# EAGLE design TCC_COMPLETO1 (EAGLE 4.16)
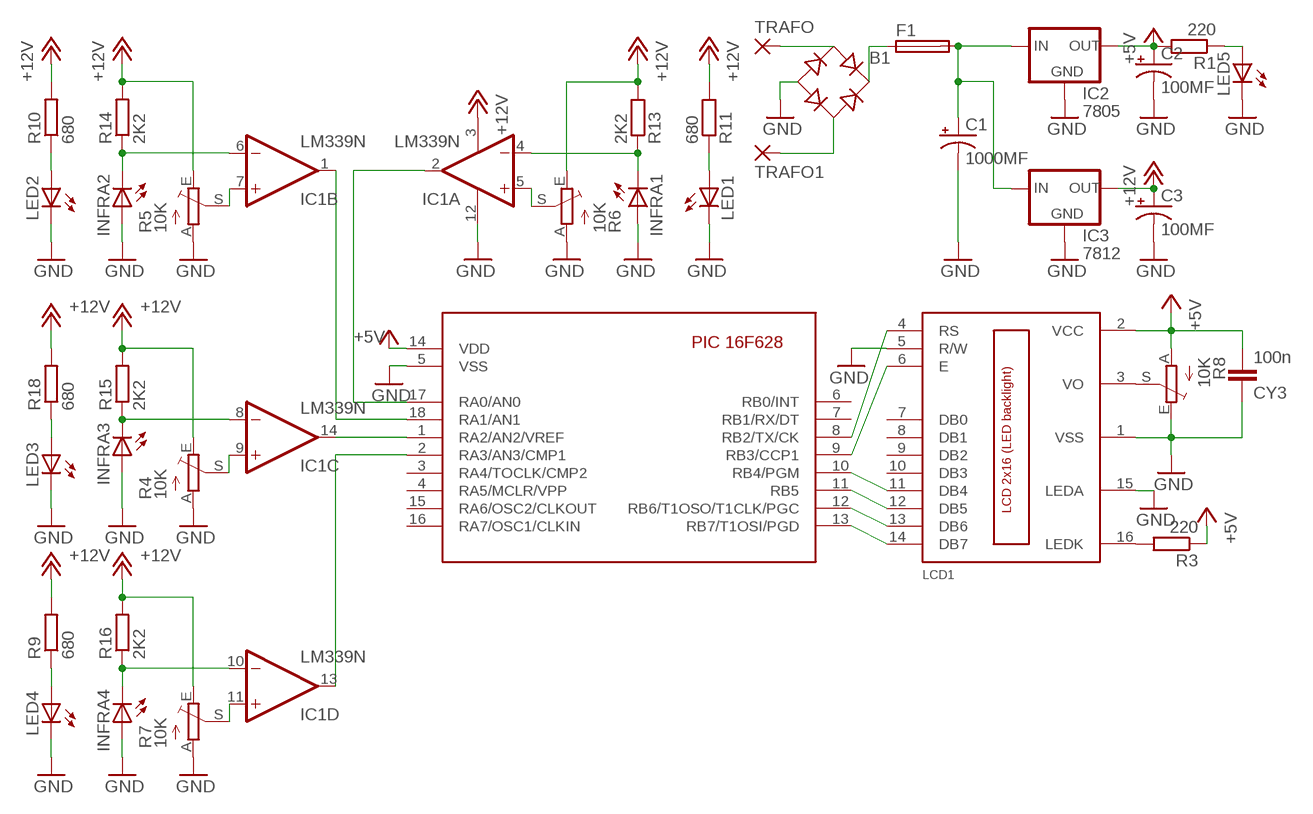
[diagram p0: schematic, sheet 1]

## Parts
B1  RB1A  [RB1A]
C1  1000MF  CPOL-USE5-10.5  [E5-10,5]
C2  100MF  CPOL-USE5-8.5  [E5-8,5]
C3  100MF  CPOL-USE5-8.5  [E5-8,5]
CY3  100n  CYYC7B5  [YC7B5]
F1  SH22,5  [SH22,5]
IC1  LM339N  [DIL14]
IC2  7805  78XXS  [78XXS]
IC3  7812  78XXS  [78XXS]
INFRA1  LED5MM  [LED5MM]
INFRA2  LED5MM  [LED5MM]
INFRA3  LED5MM  [LED5MM]
INFRA4  LED5MM  [LED5MM]
LCD1  LCD_2X16  [HY-1602F]
LED1  LED5MM  [LED5MM]
LED2  LED5MM  [LED5MM]
LED3  LED5MM  [LED5MM]
LED4  LED5MM  [LED5MM]
LED5  LED5MM  [LED5MM]
R1  220  R-EU_0309/12  [0309/12]
R3  220  R-EU_0207/10  [0207/10]
R4  10K  TRIM_EU-LI10  [LI10]
R5  10K  TRIM_EU-LI10  [LI10]
R6  10K  TRIM_EU-LI10  [LI10]
R7  10K  TRIM_EU-LI10  [LI10]
R8  10K  TRIM_EU-LI10  [LI10]
R9  680  R-EU_0309/12  [0309/12]
R10  680  R-EU_0309/12  [0309/12]
R11  680  R-EU_0309/12  [0309/12]
R13  2K2  R-EU_0207/10  [0207/10]
R14  2K2  R-EU_0207/10  [0207/10]
R15  2K2  R-EU_0207/10  [0207/10]
R16  2K2  R-EU_0207/10  [0207/10]
R18  680  R-EU_0309/12  [0309/12]
TRAFO  2,54/1,0  [2,54/1,0]
TRAFO1  2,54/1,0  [2,54/1,0]
U$1  16F628  [PIC16F628-18-LEAD-PDIP]

## Nets
+5V: C2.+ CY3.2 IC2.OUT LCD1.2(VCC) R1.2 R3.1 R8.A U$1.14(VDD)
+12V: C3.+ IC1.3(P:V+) IC3.OUT R4.E R5.E R6.E R7.E R9.2 R10.2 R11.2 R13.2 R14.2 R15.2 R16.2 R18.2
GND: B1.- C1.- C2.- C3.- CY3.1 IC1.12(P:GND) IC2.GND IC3.GND INFRA1.A INFRA2.A INFRA3.A INFRA4.A LCD1.1(VSS) LCD1.5(R/W) LCD1.15(LEDA) LED1.K(C) LED2.K(C) LED3.K(C) LED4.K(C) LED5.K(C) R4.A R5.A R6.A R7.A R8.E U$1.5(VSS)
N$1: LCD1.4(RS) U$1.8(RB2/TX/CK)
N$2: LCD1.6(E) U$1.9(RB3/CCP1)
N$3: LCD1.14(DB7) U$1.13(RB7/T1OSI/PGD)
N$4: LCD1.13(DB6) U$1.12(RB6/T1OSO/T1CLK/PGC)
N$5: LCD1.12(DB5) U$1.11(RB5)
N$6: LCD1.11(DB4) U$1.10(RB4/PGM)
N$7: IC1.5(A:+IN) R6.S
N$8: LED5.A R1.1
N$13: LCD1.3(VO) R8.S
N$14: IC1.7(B:+IN) R5.S
N$15: LCD1.16(LEDK) R3.2
N$16: IC1.11(D:+IN) R7.S
N$17: IC1.9(C:+IN) R4.S
N$18: LED1.A R11.1
N$19: LED2.A R10.1
N$20: LED3.A R18.1
N$21: LED4.A R9.1
N$22: IC1.4(A:-IN) INFRA1.K(C) R13.1
N$23: IC1.8(C:-IN) INFRA3.K(C) R15.1
N$24: IC1.10(D:-IN) INFRA4.K(C) R16.1
N$26: IC1.2(A:OUT) U$1.17(RA0/AN0)
N$27: B1.AC1 TRAFO.1(P)
N$28: C1.+ F1.2 IC2.IN IC3.IN
N$29: B1.AC2 TRAFO1.1(P)
N$30: B1.+ F1.1
N$31: IC1.1(B:OUT) U$1.18(RA1/AN1)
N$32: IC1.14(C:OUT) U$1.1(RA2/AN2/VREF)
N$33: IC1.13(D:OUT) U$1.2(RA3/AN3/CMP1)
N$34: IC1.6(B:-IN) INFRA2.K(C) R14.1
Unconnected: LCD1.7(DB0) LCD1.8(DB1) LCD1.9(DB2) LCD1.10(DB3) U$1.3(RA4/TOCLK/CMP2) U$1.4(RA5/MCLR/VPP) U$1.6(RB0/INT) U$1.7(RB1/RX/DT) U$1.15(RA6/OSC2/CLKOUT) U$1.16(RA7/OSC1/CLKIN)

## Library data of the parts
B1 = rectifier:RB1A: RECTIFIER 1 A
C1-C3 = rcl:CPOL-US: POLARIZED CAPACITOR, American symbol
CY3 = rcl:CY: Y CAPACITOR for power line
F1 = fuse:SH22,5: FUSE HOLDER grid 22,5 mm, OGN0031 8201, Schurter (Buerklin)
IC1 = linear:LM339: Low Power Low Offset Voltage Quad Comparators with open collector; LM139/LM239/LM339/LM2901/LM3302
IC2 IC3 = v-reg:78XXS: VOLTAGE REGULATOR
INFRA1-INFRA4 LED1-LED5 = led:LED: LED OSRAM: - CHIPLED LG R971, LG N971, LY N971, LG Q971, LY Q971, LO R971, LY R971 LH N974, LH R974 LS Q976, LO Q976, LY Q976 LO Q996 - Hyper CHIPLED LW Q18S LB Q993, LB Q99A, LB R99A - SideLED LS A670, LO A670, LY A670, LG A670, LP A670 LB A673, LV A673, LT A673, LW A673 LH A674 LY A675 LS A676, LA A676, LO A676, LY A676, LW A676 LS A679, LY A679, LG A679 - Hyper Micro SIDELED® LS Y876, LA Y876, LO Y876, LY Y876 LT Y87S - SmartLED LW L88C, LW L88S LB L89C, LB L89S, LG L890 LS L89K, LO L89K, LY L89K LS L896, LA L896, LO L896, LY L896 - TOPLED LS T670, LO T670, LY T670, LG T670, LP T670 LSG T670, LSP T670, LSY T670, LOP T670, LYG T670 LG T671, LOG T671, LSG T671 LB T673, LV T673, LT T673, LW T673 LH T674 LS T676, LA T676, LO T676, LY T676, LB T676, LH T676, LSB T676, LW T676 LB T67C, LV T67C, LT T67C, LS T67K, LO T67K, LY T67K, LW E67C LS E67B, LA E67B, LO E67B, LY E67B, LB E67C, LV E67C, LT E67C LW T67C LS T679, LY T679, LG T679 LS T770, LO T770, LY T770, LG T770, LP T770 LB T773, LV T773, LT T773, LW T773 LH T774 LS E675, LA E675, LY E675, LS T675 LS T776, LA T776, LO T776, LY T776, LB T776 LHGB T686 LT T68C, LB T68C - Hyper Mini TOPLED® LB M676 - Mini TOPLED Santana® LG M470 LS M47K, LO M47K, LY M47K Source: http://www.osram.convergy.de - LUMILED® LXK2-PW12-R00, LXK2-PW12-S00, LXK2-PW14-U00, LXK2-PW14-V00 LXK2-PM12-R00, LXK2-PM12-S00, LXK2-PM14-U00 LXK2-PE12-Q00, LXK2-PE12-R00, LXK2-PE12-S00, LXK2-PE14-T00, LXK2-PE14-U00 LXK2-PB12-K00, LXK2-PB12-L00, LXK2-PB12-M00, LXK2-PB14-N00, LXK2-PB14-P00, LXK2-PB14-Q00 LXK2-PR12-L00, LXK2-PR12-M00, LXK2-PR14-Q00, LXK2-PR14-R00 LXK2-PD12-Q00, LXK2-PD12-R00, LXK2-PD12-S00 LXK2-PH12-R00, LXK2-PH12-S00 LXK2-PL12-P00, LXK2-PL12-Q00, LXK2-PL12-R00 Source: www.luxeon.com
LCD1 = lcd_2x16_led_backlight:LCD_2X16
R1 R3 R9-R11 R13-R16 R18 = rcl:R-EU_: RESISTOR, European symbol
R4-R8 = pot:TRIM_EU-: POTENTIOMETER
TRAFO TRAFO1 = wirepad:2,54/1,0: THROUGH-HOLE PAD
U$1 = pic16f6xx-1:16F628: Microchip component PIC 16F628 Eric Magraner - eric_magraner@yahoo.fr 03/2004

## Board
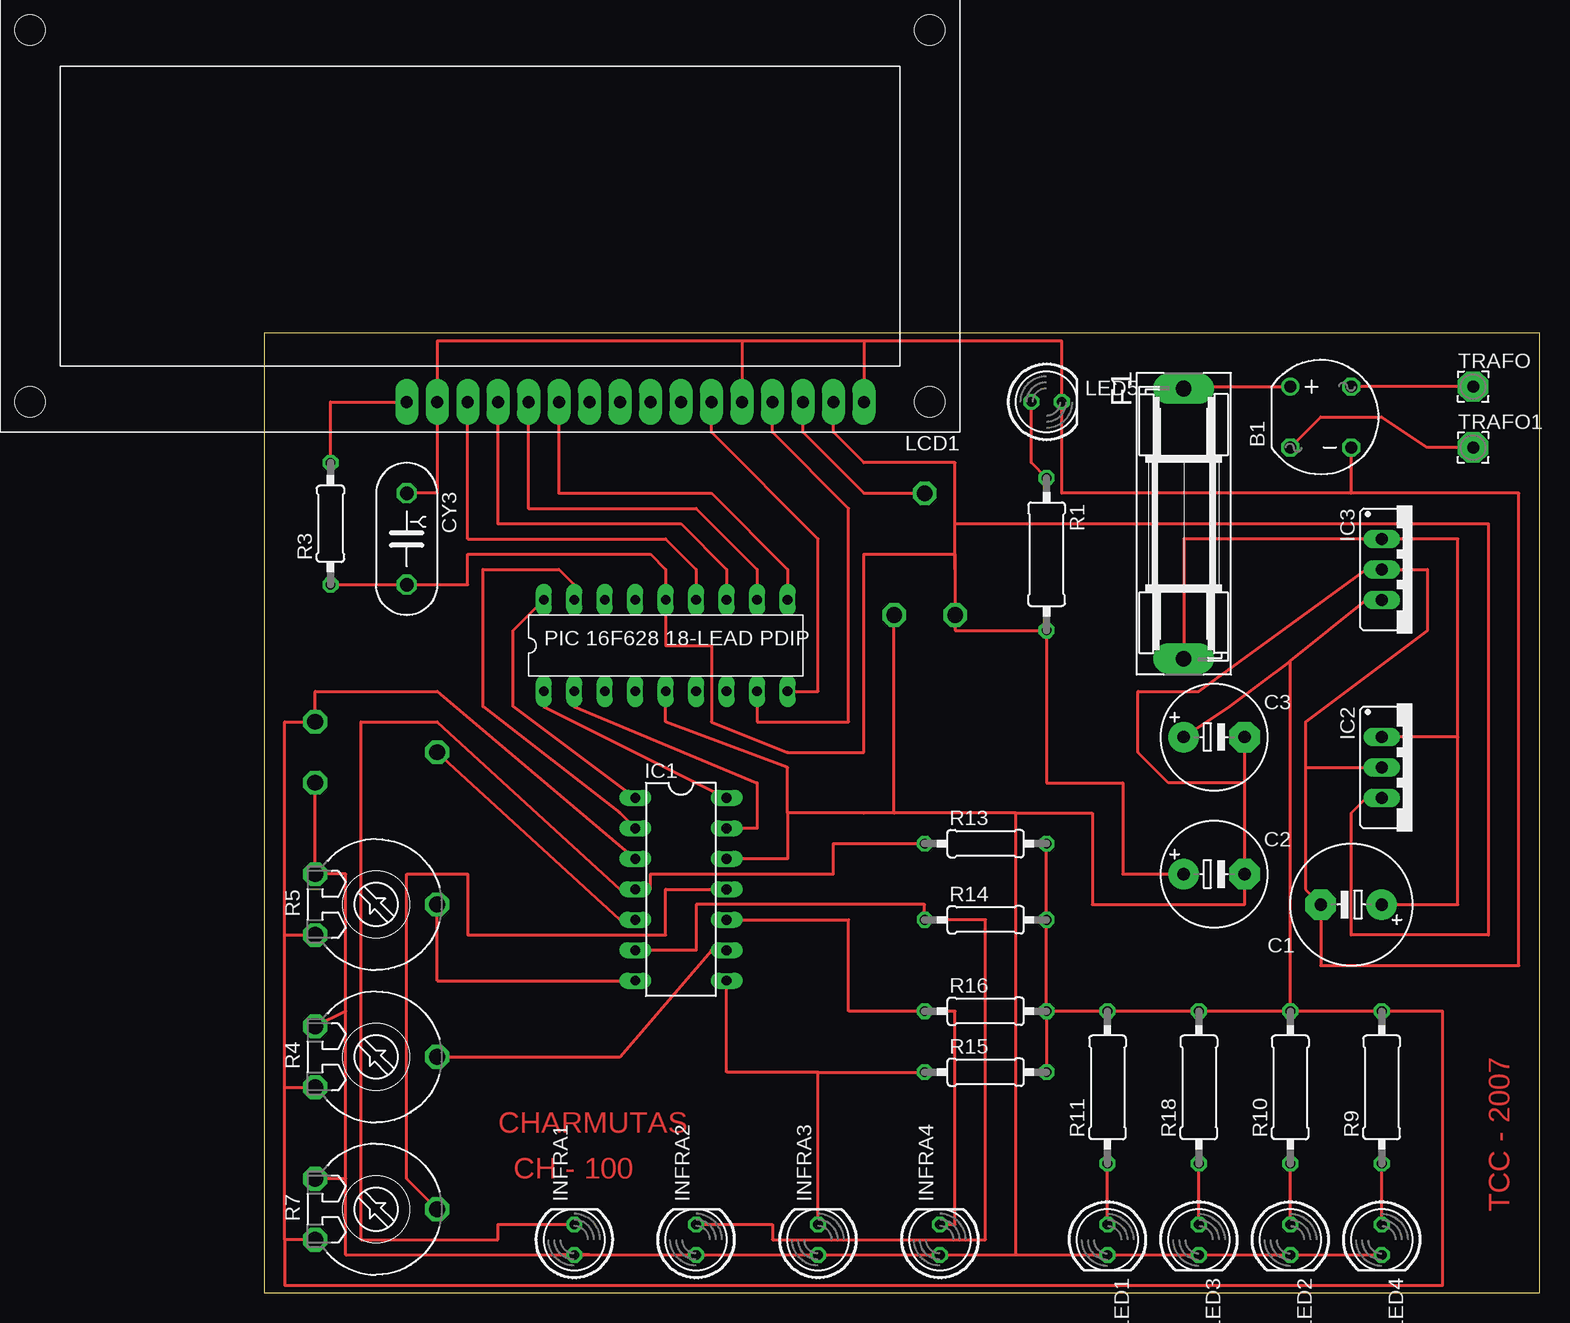
[diagram p1: board, top side]
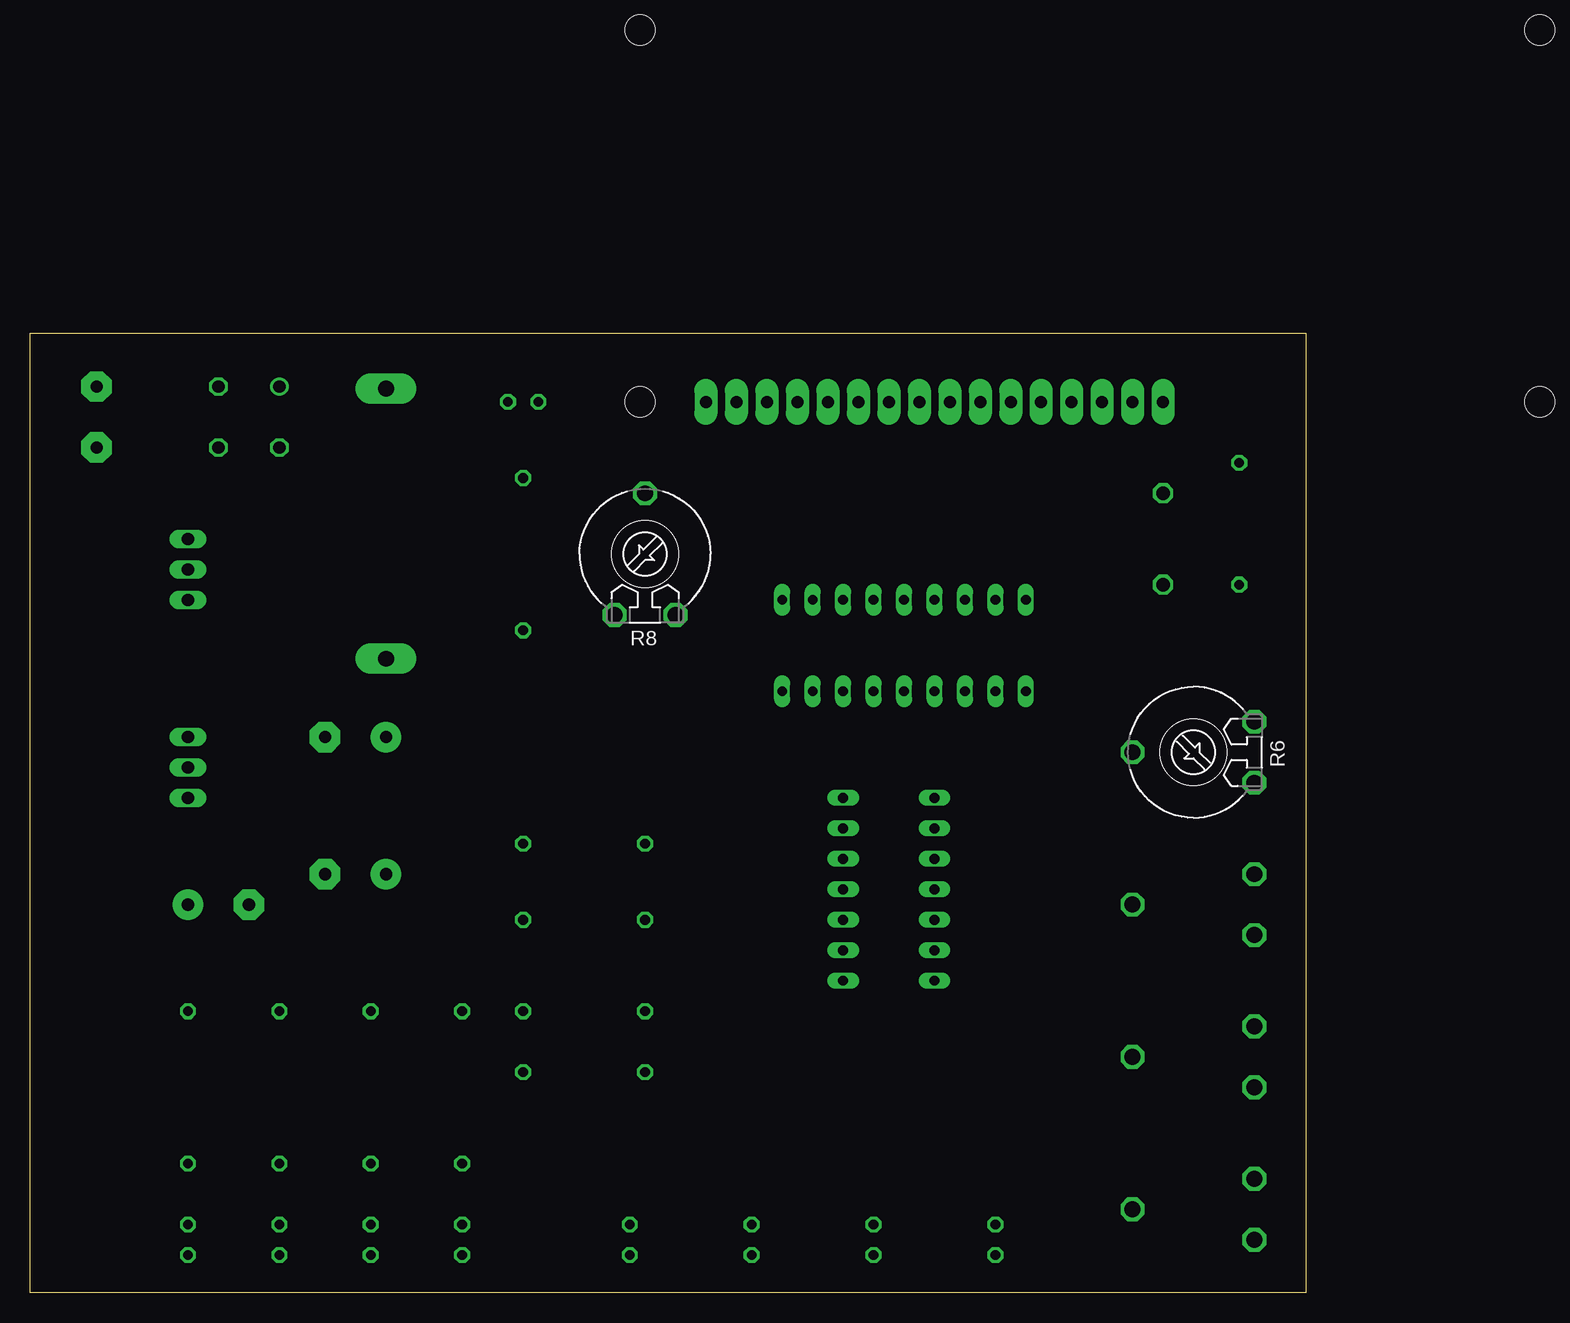
[diagram p2: board, bottom side, seen from below]

Size 106.35 x 80 mm. Coordinates in mm from the lower left corner, seen from the top.
Outline: 0,0 106.35,0 106.35,80 0,80 0,0
Copper layers 1: Top 0.035mm
Design rules "default": minimum track width 10mil, minimum drill 24mil, track to track 8mil, track to pad 8mil, pad to pad 8mil, via to via 8mil, smd to smd 8mil, copper to edge 40mil, drill to drill 8mil, minimum pad ring 10mil, minimum via ring 8mil, stop-mask expansion 4mil, vias tented up to drill 0mil, thermal gap 10mil

### Footprints (pad centres in the part's own frame; a part is rotated, then mirrored left to right if it is on the bottom)
RB1A = drill 1.016 round: + -2.54,2.54 | drill 1.016 octagon: - 2.54,-2.54; AC1 2.54,2.54; AC2 -2.54,-2.54
E5-10,5 = drill 1.016 pad 2.54 round: + -2.54,0 | drill 1.016 pad 2.54 octagon: - 2.54,0
E5-8,5 = drill 1.016 pad 2.54 round: + -2.54,0 | drill 1.016 pad 2.54 octagon: - 2.54,0
YC7B5 = drill 1.118 octagon: 1 -3.81,0; 2 3.81,0
SH22,5 = drill 1.321 pad 2.54 long: 1 -11.252,0; 2 11.252,0
DIL14 = drill 0.813 long: 1 -7.62,-3.81; 2 -5.08,-3.81; 3 -2.54,-3.81; 4 0,-3.81; 5 2.54,-3.81; 6 5.08,-3.81; 7 7.62,-3.81; 8 7.62,3.81; 9 5.08,3.81; 10 2.54,3.81; 11 0,3.81; 12 -2.54,3.81; 13 -5.08,3.81; 14 -7.62,3.81
78XXS = drill 1.016 long: GND 0,-2.54; IN -2.54,-2.54; OUT 2.54,-2.54
LED5MM = drill 0.813 octagon: A -1.27,0; K 1.27,0
HY-1602F = drill 1 pad 1.93 long: 1 2.54,0; 2 5.08,0; 3 7.62,0; 4 10.16,0; 5 12.7,0; 6 15.24,0; 7 17.78,0; 8 20.32,0; 9 22.86,0; 10 25.4,0; 11 27.94,0; 12 30.48,0; 13 33.02,0; 14 35.56,0; 15 38.1,0; 16 40.64,0 | hole 2.5: -2.96,0; 72.04,0; -2.96,-31; 72.04,-31
0309/12 = drill 0.813 octagon: 1 -6.35,0; 2 6.35,0
0207/10 = drill 0.813 octagon: 1 -5.08,0; 2 5.08,0
LI10 = drill 1.321 octagon: A -2.54,-5.08; E 2.54,-5.08; S 0,5.08
2,54/1,0 = drill 1.016 pad 2.54 octagon: 1 0,0
PIC16F628-18-LEAD-PDIP = drill 0.813 long: 1 -10.16,-3.81; 2 -7.62,-3.81; 3 -5.08,-3.81; 4 -2.54,-3.81; 5 0,-3.81; 6 2.54,-3.81; 7 5.08,-3.81; 8 7.62,-3.81; 9 10.16,-3.81; 10 10.16,3.81; 11 7.62,3.81; 12 5.08,3.81; 13 2.54,3.81; 14 0,3.81; 15 -2.54,3.81; 16 -5.08,3.81; 17 -7.62,3.81; 18 -10.16,3.81

### Placement (x,y rotation side)
B1  88.1,73.02 0 top
C1  90.64,32.38 180 top
C2  79.21,34.92 0 top
C3  79.21,46.35 0 top
CY3  11.9,62.86 270 top
F1  76.67,64.13 270 top
IC1  34.76,33.65 270 top
IC2  95.72,43.81 270 top
IC3  95.72,60.32 270 top
INFRA1  25.87,4.44 90 top
INFRA2  36.03,4.44 90 top
INFRA3  46.19,4.44 90 top
INFRA4  56.35,4.44 90 top
LCD1  52.54,74.29 180 top
LED1  70.32,4.44 270 top
LED2  85.56,4.44 270 top
LED3  77.94,4.44 270 top
LED4  93.18,4.44 270 top
LED5  65.24,74.29 0 top
R1  65.24,61.59 270 top
R3  5.55,64.13 90 top
R4  9.36,19.68 270 top
R5  9.36,32.38 270 top
R6  9.36,45.08 90 bottom
R7  9.36,6.98 270 top
R8  55.08,61.59 0 bottom
R9  93.18,17.14 90 top
R10  85.56,17.14 90 top
R11  70.32,17.14 90 top
R13  60.16,37.46 0 top
R14  60.16,31.11 0 top
R15  60.16,18.41 0 top
R16  60.16,23.49 0 top
R18  77.94,17.14 90 top
TRAFO  100.8,75.56 0 top
TRAFO1  100.8,70.48 0 top
U$1  33.49,53.97 0 top

### Tracks (layer width: path | path; a pad name or v marks a point on that pad's centre or on a via)
+5V
  Top 0.254: 10.63,59.05 CY3.2 | 33.49,60.32 32.22,61.59 16.98,61.59 16.98,59.05 10.63,59.05 | R3.1 10.63,59.05 | 33.49,60.32 U$1.14 | 33.49,60.32 33.49,53.97 37.3,53.97 37.3,47.62 43.65,45.08 50,45.08 50,61.59 57.62,61.59 57.62,60.32 | 57.62,60.32 R8.A 57.62,55.24 R1.2 65.24,42.54 71.59,42.54 71.59,34.92 C2.+ | LCD1.2 47.46,71.75 50,69.21 57.62,69.21 57.62,64.13 | 57.62,60.32 57.62,64.13 | 57.62,64.13 102.07,64.13 102.07,29.84 90.64,29.84 90.64,40 91.91,41.27 IC2.OUT
+12V
  Top 0.254: 1.74,17.14 R4.E | 1.74,29.84 R5.E | 1.74,17.14 1.74,29.84 | 1.74,29.84 1.74,47.62 R6.E 4.28,50.16 14.44,50.16 IC1.3 | R16.2 R15.2 | R16.2 R11.2 R18.2 R10.2 | R16.2 R14.2 R13.2 | R10.2 R9.2 98.26,23.49 98.26,0.63 1.74,0.63 1.74,4.44 | 85.56,52.7 91.91,57.78 IC3.OUT | R10.2 85.56,52.7 | C3.+ 80.48,48.89 85.56,52.7 | 1.74,4.44 1.74,17.14 | R7.E 1.74,4.44
GND
  Top 0.254: 39.84,79.37 14.44,79.37 LCD1.15 14.44,66.67 CY3.1 | 39.84,79.37 LCD1.5 | 50,79.37 66.51,79.37 LED5.K 66.51,66.67 90.64,66.67 | R6.A R5.A 6.82,34.92 6.82,23.49 | 6.82,23.49 R4.A | 27.14,3.17 INFRA1.A 24.6,3.17 | 27.14,3.17 INFRA2.A INFRA3.A INFRA4.A 62.7,3.17 | LED4.K LED2.K LED3.K LED1.K 62.7,3.17 | 6.82,9.52 6.82,3.17 27.14,3.17 | 6.82,9.52 6.82,23.49 | 6.82,9.52 R7.A | 52.54,40 R8.E | U$1.5 33.49,47.62 43.65,43.81 43.65,40 | IC1.12 43.65,36.19 43.65,40 | 50,79.37 LCD1.1 | 50,79.37 39.84,79.37 | 81.75,42.54 75.4,42.54 72.86,45.08 72.86,50.16 77.94,50.16 91.91,60.32 IC3.GND 96.99,60.32 96.99,55.24 86.83,47.62 86.83,43.81 | 81.75,42.54 C3.- | 81.75,42.54 C2.- 81.75,32.38 69.05,32.38 69.05,40 62.7,40 | 62.7,40 52.54,40 | 52.54,40 50,40 | 90.64,66.67 B1.- | 90.64,66.67 104.61,66.67 104.61,27.3 88.1,27.3 C1.- 86.83,33.65 86.83,43.81 | 50,40 43.65,40 | 62.7,40 50,40 | 62.7,3.17 62.7,40 | 86.83,43.81 IC2.GND
N$1
  Top 0.254: U$1.8 41.11,47.62 48.73,47.62 48.73,65.4 42.38,71.75 LCD1.4
N$2
  Top 0.254: U$1.9 46.19,50.16 46.19,62.86 37.3,71.75 LCD1.6
N$3
  Top 0.254: U$1.13 36.03,60.32 33.49,62.86 16.98,62.86 LCD1.14
N$4
  Top 0.254: U$1.12 38.57,60.32 34.76,64.13 19.52,64.13 LCD1.13
N$5
  Top 0.254: U$1.11 41.11,60.32 36.03,65.4 22.06,65.4 LCD1.12
N$6
  Top 0.254: LCD1.11 24.6,66.67 37.3,66.67 43.65,60.32 U$1.10
N$7
  Top 0.254: R6.S 29.68,31.11 IC1.5
N$8
  Top 0.254: R1.1 63.97,69.21 LED5.A
N$13
  Top 0.254: R8.S 50,66.67 44.92,71.75 LCD1.3
N$14
  Top 0.254: R5.S 14.44,26.03 IC1.7
N$15
  Top 0.254: R3.2 5.55,74.29 LCD1.16
N$16
  Top 0.254: R7.S 11.9,9.52 11.9,34.92 16.98,34.92 16.98,29.84 33.49,29.84 33.49,33.65 IC1.11
N$17
  Top 0.254: R4.S 29.68,19.68 37.3,28.57 IC1.9
N$18
  Top 0.254: LED1.A R11.1
N$19
  Top 0.254: LED2.A R10.1
N$20
  Top 0.254: LED3.A R18.1
N$21
  Top 0.254: LED4.A R9.1
N$22
  Top 0.254: INFRA1.K 19.52,5.71 19.52,4.44 8.09,4.44 8.09,47.62 14.44,47.62 29.68,33.65 IC1.4 32.22,33.65 32.22,34.92 47.46,34.92 47.46,37.46 R13.1
N$23
  Top 0.254: 46.19,18.41 R15.1 | 46.19,18.41 38.57,18.41 IC1.8 | INFRA3.K 46.19,18.41
N$24
  Top 0.254: IC1.10 48.73,31.11 48.73,23.49 R16.1 57.62,23.49 57.62,5.71 INFRA4.K
N$26
  Top 0.254: IC1.2 29.68,40 18.25,48.89 18.25,60.32 24.6,60.32 25.87,59.05 U$1.17
N$27
  Top 0.254: TRAFO.1 B1.AC1
N$28
  Top 0.254: 99.53,46.35 99.53,32.38 C1.+ | 99.53,46.35 IC2.IN | 99.53,46.35 99.53,62.86 IC3.IN 76.67,62.86 F1.2
N$29
  Top 0.254: B1.AC2 88.1,73.02 93.18,73.02 96.99,70.48 TRAFO1.1
N$30
  Top 0.254: B1.+ 77.94,75.56 F1.1
N$31
  Top 0.254: U$1.18 20.79,55.24 20.79,48.89 IC1.1
N$32
  Top 0.254: U$1.1 23.33,48.89 IC1.14
N$33
  Top 0.254: IC1.13 41.11,38.73 41.11,42.54 25.87,48.89 U$1.2
N$34
  Top 0.254: INFRA2.K 42.38,5.71 42.38,4.44 60.16,4.44 60.16,31.11 R14.1 55.08,32.38 36.03,32.38 36.03,28.57 IC1.6

### Text on the board
Top: TCC - 2007 | CHARMUTAS | CH - 100